# Altium project LaunchyRIO.PrjPcb
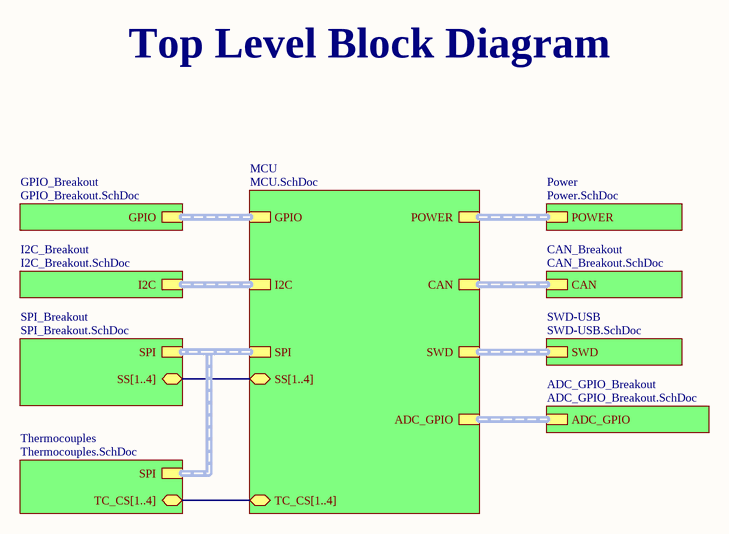
[diagram p0: MainSchematic.SchDoc]
11 sheets, 82 parts. Net scope: hierarchical (ports join the sheet entries above them; power ports are global).
Board file: LaunchyRIO-NoPour.PcbDoc
Sheets:
  MainSchematic.SchDoc
    I2C_Breakout = I2C_Breakout.SchDoc
    MCU = MCU.SchDoc
    GPIO_Breakout = GPIO_Breakout.SchDoc
    SPI_Breakout = SPI_Breakout.SchDoc
    CAN_Breakout = CAN_Breakout.SchDoc
    ADC_GPIO_Breakout = ADC_GPIO_Breakout.SchDoc
    SWD-USB = SWD-USB.SchDoc
    Power = Power.SchDoc
    Thermocouples = Thermocouples.SchDoc
      Thermocouple_Amplifier1 = Thermocouple_Amplifier.SchDoc
      Thermocouple_Amplifier2 = Thermocouple_Amplifier.SchDoc
      Thermocouple_Amplifier3 = Thermocouple_Amplifier.SchDoc
      Thermocouple_Amplifier4 = Thermocouple_Amplifier.SchDoc

## Sheet MainSchematic.SchDoc
size Letter; Organization: Altium Limited; Address1: L3, 12a Rodborough Rd; Address2: Frenchs Forest; Address3: NSW; Address4: Australia 2086

### Sub-sheets
ADC_GPIO_Breakout = ADC_GPIO_Breakout.SchDoc: ADC_GPIO (harness ADC_GPIO)
CAN_Breakout = CAN_Breakout.SchDoc: CAN (harness CAN)
GPIO_Breakout = GPIO_Breakout.SchDoc: GPIO (harness GPIO)
I2C_Breakout = I2C_Breakout.SchDoc: I2C (harness I2C)
MCU = MCU.SchDoc: I2C (harness I2C), GPIO (harness GPIO), SPI (harness SPI), ADC_GPIO (harness ADC_GPIO), CAN (harness CAN), SWD (harness SWD), POWER (harness POWER), TC_CS[1..4] (bidir), SS[1..4] (bidir)
Power = Power.SchDoc: POWER (harness POWER)
SPI_Breakout = SPI_Breakout.SchDoc: SPI (harness SPI), SS[1..4] (bidir)
SWD-USB = SWD-USB.SchDoc: SWD (harness SWD)
Thermocouples = Thermocouples.SchDoc: SPI (harness SPI), TC_CS[1..4] (bidir)

### Buses and harness runs
bus sheet MCU/SS[1..4] = sheet SPI_Breakout/SS[1..4]
bus sheet MCU/TC_CS[1..4] = sheet Thermocouples/TC_CS[1..4]
harness sheet ADC_GPIO_Breakout/ADC_GPIO = sheet MCU/ADC_GPIO
harness sheet CAN_Breakout/CAN = sheet MCU/CAN
harness sheet GPIO_Breakout/GPIO = sheet MCU/GPIO
harness sheet I2C_Breakout/I2C = sheet MCU/I2C
harness sheet MCU/POWER = sheet Power/POWER
harness sheet MCU/SPI = sheet SPI_Breakout/SPI = sheet Thermocouples/SPI
harness sheet MCU/SWD = sheet SWD-USB/SWD

### Notes on the sheet
- Top Level Block Diagram
- Title
- Size:
- Date:
- Letter
- Number:
- Time:
- Revision:
- Sheet
- of
- File:

## Sheet I2C_Breakout.SchDoc
size Letter; Organization: Altium Limited; Address1: L3, 12a Rodborough Rd; Address2: Frenchs Forest; Address3: NSW; Address4: Australia 2086
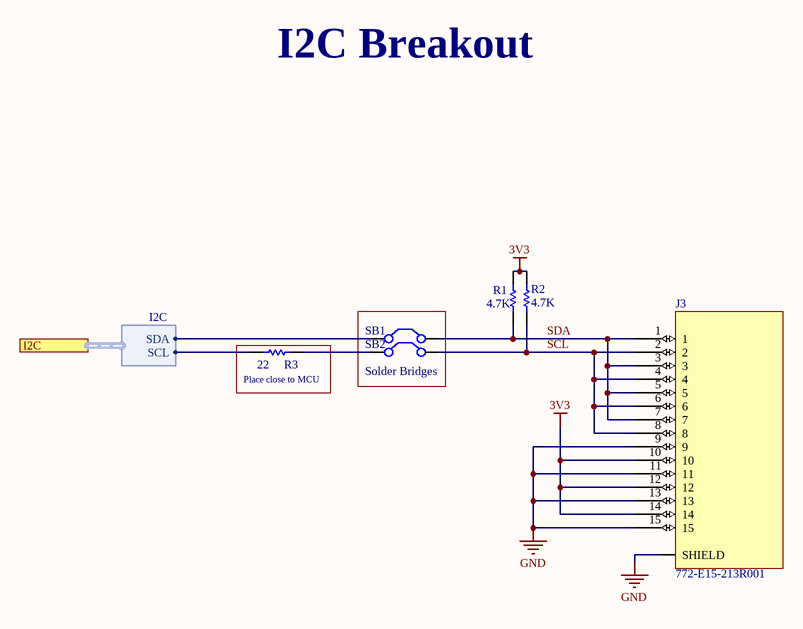
[diagram p1: I2C_Breakout.SchDoc]

### Parts
J3  772-E15-213R001  [15-Pos D-Sub]
R1  value 4.7K  [0402]  (hidden comment: Res1)
R2  value 4.7K  [0402]  (hidden comment: Res1)
R3  value 22  [0402]  (hidden comment: Res1)
SB1  Solder Bridge  [SB-2pos]  (value not drawn)
SB2  Solder Bridge  [SB-2pos]  (value not drawn)

### Blocks framed on the sheet
Place close to MCU: R3
Solder Bridges: SB1 SB2

### Ports
I2C (harness I2C)

### Harnesses
I2C: SDA, SCL

### Nets
3V3: J3.10 J3.12 J3.14 R1.2 R2.2
GND: J3.9 J3.11 J3.13 J3.15 J3.SHIELD
SCL: J3.2 J3.4 J3.6 J3.8 R2.1 SB2.2(C2)
SDA: J3.1 J3.3 J3.5 J3.7 R1.1 SB1.2(C2)
NetR3_1: R3.1 ; port I2C.SCL
NetR3_2: R3.2 SB2.1(C1)
NetSB1_1: SB1.1(C1) ; port I2C.SDA

### Notes on the sheet
- I2C Breakout
- Title
- Size:
- Date:
- Letter
- Number:
- Time:
- Revision:
- Sheet
- of
- File:

### Library data of the parts
J3 = 15-Position Connector: Number of Positions: 15; Connector Type: Receptacle, Female Sockets; Current Rating: 5A; Ingress Protection: IP67 - Dust Tight, Waterproof; Material Flammability Rating: UL94 V-0; Mounting Type: Panel Mount, Through Hole; Operating Temperature: -50°C ~ 100°C; Contact Type: Signal; Shell Material, Finish: Steel, Nickel Plated; Contact Finish: Gold; Manufacturer Part Number: 772-E15-213R001; DigiKey Part Number: NOR1010-ND
R1-R3 = Res1: Resistor
SB1 SB2 = Jumper: Jumper Wire

## Sheet MCU.SchDoc
size Letter; Organization: Altium Limited; Address1: L3, 12a Rodborough Rd; Address2: Frenchs Forest; Address3: NSW; Address4: Australia 2086
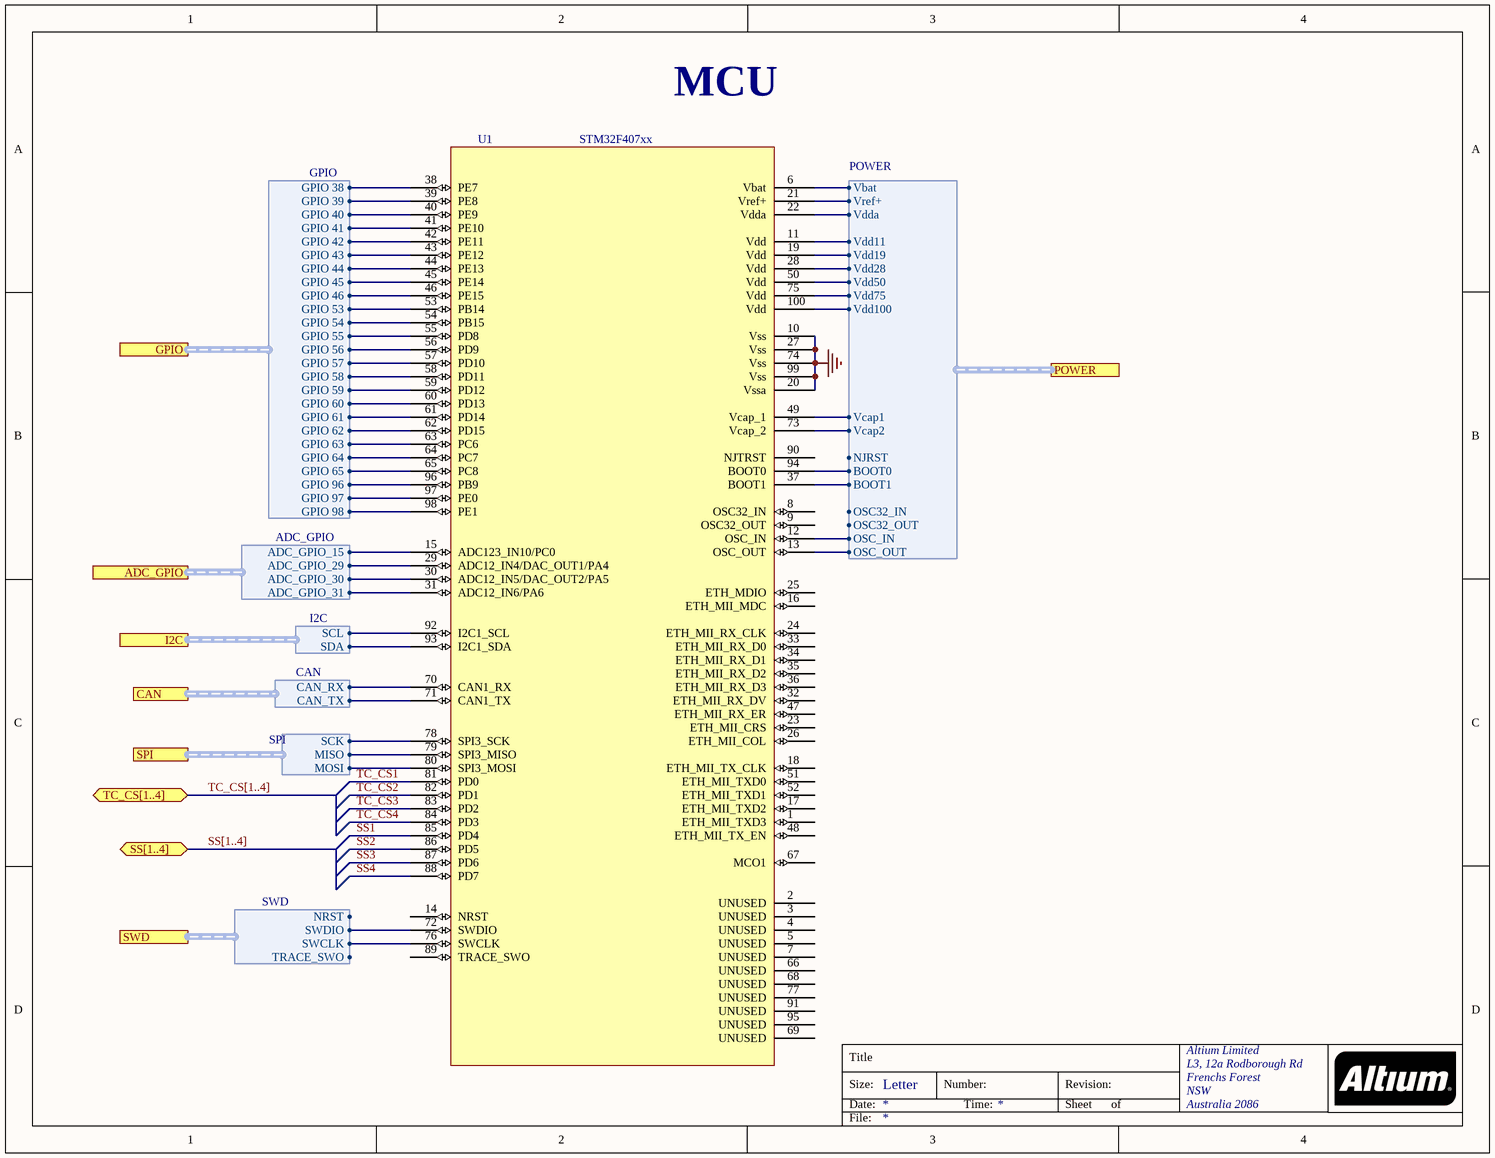
[diagram p2: MCU.SchDoc]

### Parts
U1  STM32F407xx  [LQFP100]

### Ports
ADC_GPIO (harness ADC_GPIO), CAN (harness CAN), GPIO (harness GPIO), I2C (harness I2C), POWER (harness POWER), SPI (harness SPI), SS[1..4] (bidir), SWD (harness SWD), TC_CS[1..4] (bidir)

### Harnesses
I2C: SCL, SDA
GPIO: GPIO 38, GPIO 39, GPIO 40, GPIO 41, GPIO 42, GPIO 43, GPIO 44, GPIO 45, GPIO 46, GPIO 53, GPIO 54, GPIO 55, GPIO 56, GPIO 57, GPIO 58, GPIO 59, GPIO 60, GPIO 61, GPIO 62, GPIO 63, GPIO 64, GPIO 65, GPIO 96, GPIO 97, GPIO 98
ADC_GPIO: ADC_GPIO_15, ADC_GPIO_29, ADC_GPIO_30, ADC_GPIO_31
CAN: CAN_RX, CAN_TX
SWD: NRST, SWDIO, SWCLK, TRACE_SWO
POWER: Vbat, Vref+, Vdda, Vcap1, Vcap2, NJRST, BOOT0, BOOT1, OSC32_IN, OSC32_OUT, OSC_IN, OSC_OUT, Vdd11, Vdd19, Vdd28, Vdd50, Vdd75, Vdd100
SPI: SCK, MISO, MOSI

### Nets
GND: U1.10(Vss) U1.20(Vssa) U1.27(Vss) U1.74(Vss) U1.99(Vss)
GPIO 38: U1.38(PE7) ; port GPIO.GPIO 38
GPIO 39: U1.39(PE8) ; port GPIO.GPIO 39
GPIO 40: U1.40(PE9) ; port GPIO.GPIO 40
GPIO 41: U1.41(PE10) ; port GPIO.GPIO 41
GPIO 42: U1.42(PE11) ; port GPIO.GPIO 42
GPIO 43: U1.43(PE12) ; port GPIO.GPIO 43
GPIO 44: U1.44(PE13) ; port GPIO.GPIO 44
GPIO 45: U1.45(PE14) ; port GPIO.GPIO 45
GPIO 46: U1.46(PE15) ; port GPIO.GPIO 46
GPIO 53: U1.53(PB14) ; port GPIO.GPIO 53
GPIO 54: U1.54(PB15) ; port GPIO.GPIO 54
GPIO 55: U1.55(PD8) ; port GPIO.GPIO 55
GPIO 56: U1.56(PD9) ; port GPIO.GPIO 56
GPIO 57: U1.57(PD10) ; port GPIO.GPIO 57
GPIO 58: U1.58(PD11) ; port GPIO.GPIO 58
GPIO 59: U1.59(PD12) ; port GPIO.GPIO 59
GPIO 60: U1.60(PD13) ; port GPIO.GPIO 60
GPIO 61: U1.61(PD14) ; port GPIO.GPIO 61
GPIO 62: U1.62(PD15) ; port GPIO.GPIO 62
GPIO 63: U1.63(PC6) ; port GPIO.GPIO 63
GPIO 64: U1.64(PC7) ; port GPIO.GPIO 64
GPIO 65: U1.65(PC8) ; port GPIO.GPIO 65
GPIO 96: U1.96(PB9) ; port GPIO.GPIO 96
GPIO 97: U1.97(PE0) ; port GPIO.GPIO 97
GPIO 98: U1.98(PE1) ; port GPIO.GPIO 98
SS1: U1.85(PD4)
SS2: U1.86(PD5)
SS3: U1.87(PD6)
SS4: U1.88(PD7)
T_JTCK: U1.76(SWCLK) ; port SWD.SWCLK
T_JTMS: U1.72(SWDIO) ; port SWD.SWDIO
TC_CS1: U1.81(PD0)  [project net CS]
TC_CS2: U1.82(PD1)  [project net CS]
TC_CS3: U1.83(PD2)  [project net CS]
TC_CS4: U1.84(PD3)  [project net CS]
NetC22_2: U1.6(Vbat) ; port POWER.Vbat
NetC23_2: U1.100(Vdd) ; port POWER.Vdd100
NetC24_2: U1.75(Vdd) ; port POWER.Vdd75
NetC25_2: U1.50(Vdd) ; port POWER.Vdd50
NetC26_2: U1.28(Vdd) ; port POWER.Vdd28
NetC27_2: U1.19(Vdd) ; port POWER.Vdd19
NetC28_2: U1.11(Vdd) ; port POWER.Vdd11
NetC29_2: U1.49(Vcap_1) ; port POWER.Vcap1
NetC30_2: U1.73(Vcap_2) ; port POWER.Vcap2
NetC31_2: U1.22(Vdda) ; port POWER.Vdda
NetC33_1: U1.21(Vref+) ; port POWER.Vref+
NetJ4_1: U1.15(ADC123_IN10/PC0) ; port ADC_GPIO.ADC_GPIO_15
NetJ4_2: U1.29(ADC12_IN4/DAC_OUT1/PA4) ; port ADC_GPIO.ADC_GPIO_29
NetJ4_3: U1.30(ADC12_IN5/DAC_OUT2/PA5) ; port ADC_GPIO.ADC_GPIO_30
NetJ4_4: U1.31(ADC12_IN6/PA6) ; port ADC_GPIO.ADC_GPIO_31
NetR3_1: U1.92(I2C1_SCL) ; port I2C.SCL
NetR7_1: U1.78(SPI3_SCK) ; port SPI.SCK
NetR16_2: U1.12(OSC_IN) ; port POWER.OSC_IN
NetR17_2: U1.94(BOOT0) ; port POWER.BOOT0
NetR18_2: U1.37(BOOT1) ; port POWER.BOOT1
NetSB1_1: U1.93(I2C1_SDA) ; port I2C.SDA
NetSB3_1: U1.79(SPI3_MISO) ; port SPI.MISO
NetSB4_1: U1.80(SPI3_MOSI) ; port SPI.MOSI
NetSB11_1: U1.13(OSC_OUT) ; port POWER.OSC_OUT
NetU1_70: U1.70(CAN1_RX) ; port CAN.CAN_RX
NetU1_71: U1.71(CAN1_TX) ; port CAN.CAN_TX

Not connected (* = marked no-connect by the designer): U1 1(ETH_MII_TXD3) 2(UNUSED) 3(UNUSED) 4(UNUSED) 5(UNUSED) 7(UNUSED) 8(OSC32_IN) 9(OSC32_OUT) 14(NRST) 16(ETH_MII_MDC) 17(ETH_MII_TXD2) 18(ETH_MII_TX_CLK) 23(ETH_MII_CRS) 24(ETH_MII_RX_CLK) 25(ETH_MDIO) 26(ETH_MII_COL) 32(ETH_MII_RX_DV) 33(ETH_MII_RX_D0) 34(ETH_MII_RX_D1) 35(ETH_MII_RX_D2) 36(ETH_MII_RX_D3) 47(ETH_MII_RX_ER) 48(ETH_MII_TX_EN) 51(ETH_MII_TXD0) 52(ETH_MII_TXD1) 66(UNUSED) 67(MCO1) 68(UNUSED) 69(UNUSED) 77(UNUSED) 89(TRACE_SWO) 90(NJTRST) 91(UNUSED) 95(UNUSED)

### Buses and harness runs
bus SS[1..4] = port SS[1..4]
bus TC_CS[1..4] = port TC_CS[1..4]

### Notes on the sheet
- MCU
- Title
- Size:
- Date:
- Letter
- Number:
- Time:
- Revision:
- Sheet
- of
- File:

## Sheet GPIO_Breakout.SchDoc
size Letter; Organization: Altium Limited; Address1: L3, 12a Rodborough Rd; Address2: Frenchs Forest; Address3: NSW; Address4: Australia 2086
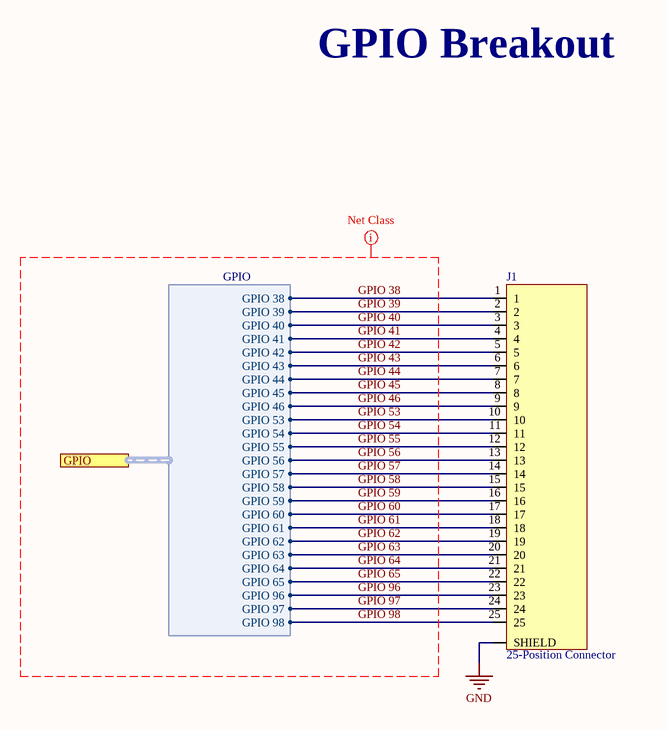
[diagram p3: GPIO_Breakout.SchDoc]

### Parts
J1  25-Position Connector  [25-POS D-SUB]

### Ports
GPIO (harness GPIO)

### Harnesses
GPIO: GPIO 38, GPIO 39, GPIO 40, GPIO 41, GPIO 42, GPIO 43, GPIO 44, GPIO 45, GPIO 46, GPIO 53, GPIO 54, GPIO 55, GPIO 56, GPIO 57, GPIO 58, GPIO 59, GPIO 60, GPIO 61, GPIO 62, GPIO 63, GPIO 64, GPIO 65, GPIO 96, GPIO 97, GPIO 98

### Nets
GND: J1.SHIELD
GPIO 38: J1.1 ; port GPIO.GPIO 38
GPIO 39: J1.2 ; port GPIO.GPIO 39
GPIO 40: J1.3 ; port GPIO.GPIO 40
GPIO 41: J1.4 ; port GPIO.GPIO 41
GPIO 42: J1.5 ; port GPIO.GPIO 42
GPIO 43: J1.6 ; port GPIO.GPIO 43
GPIO 44: J1.7 ; port GPIO.GPIO 44
GPIO 45: J1.8 ; port GPIO.GPIO 45
GPIO 46: J1.9 ; port GPIO.GPIO 46
GPIO 53: J1.10 ; port GPIO.GPIO 53
GPIO 54: J1.11 ; port GPIO.GPIO 54
GPIO 55: J1.12 ; port GPIO.GPIO 55
GPIO 56: J1.13 ; port GPIO.GPIO 56
GPIO 57: J1.14 ; port GPIO.GPIO 57
GPIO 58: J1.15 ; port GPIO.GPIO 58
GPIO 59: J1.16 ; port GPIO.GPIO 59
GPIO 60: J1.17 ; port GPIO.GPIO 60
GPIO 61: J1.18 ; port GPIO.GPIO 61
GPIO 62: J1.19 ; port GPIO.GPIO 62
GPIO 63: J1.20 ; port GPIO.GPIO 63
GPIO 64: J1.21 ; port GPIO.GPIO 64
GPIO 65: J1.22 ; port GPIO.GPIO 65
GPIO 96: J1.23 ; port GPIO.GPIO 96
GPIO 97: J1.24 ; port GPIO.GPIO 97
GPIO 98: J1.25 ; port GPIO.GPIO 98

### Layout directives
net class GPIO: GPIO 38, GPIO 39, GPIO 40, GPIO 41, GPIO 42, GPIO 43, GPIO 44, GPIO 45, GPIO 46, GPIO 53, GPIO 54, GPIO 55, GPIO 56, GPIO 57, GPIO 58, GPIO 59, GPIO 60, GPIO 61, GPIO 62, GPIO 63, GPIO 64, GPIO 65, GPIO 96, GPIO 97, GPIO 98

### Notes on the sheet
- GPIO Breakout
- Title
- Size:
- Date:
- Letter
- Number:
- Time:
- Revision:
- Sheet
- of
- File:

### Library data of the parts
J1 = 25-Position Connector: Manufacturer Part Number: 772-E25-213R051; DigiKey Part Number: NOR1066-ND

## Sheet SPI_Breakout.SchDoc
size Letter; Organization: Altium Limited; Address1: L3, 12a Rodborough Rd; Address2: Frenchs Forest; Address3: NSW; Address4: Australia 2086
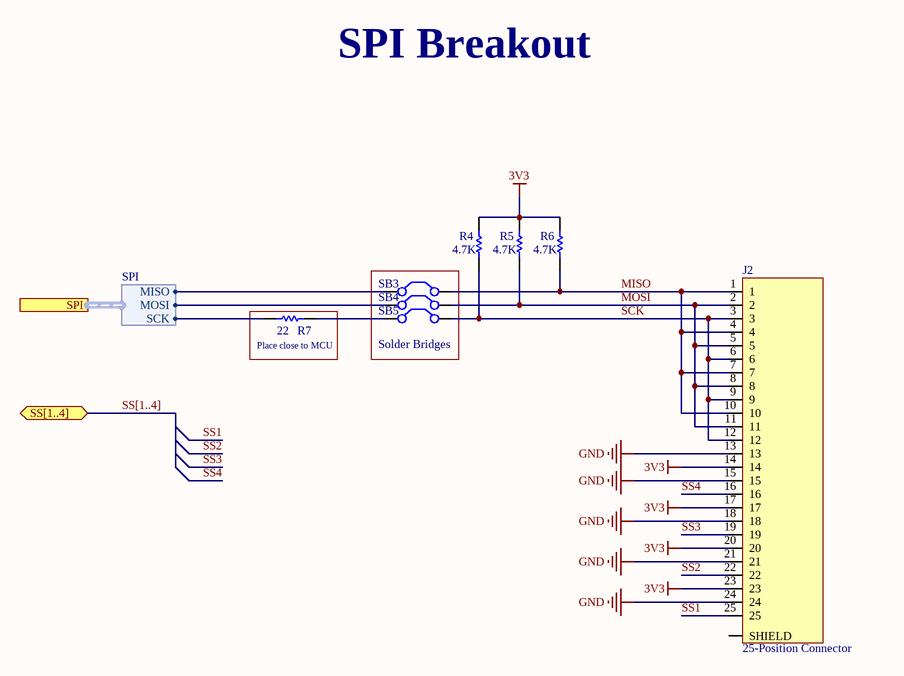
[diagram p4: SPI_Breakout.SchDoc]

### Parts
J2  25-Position Connector  [25-POS D-SUB]
R4  value 4.7K  [0402]  (hidden comment: Res1)
R5  value 4.7K  [0402]  (hidden comment: Res1)
R6  value 4.7K  [0402]  (hidden comment: Res1)
R7  value 22  [0402]  (hidden comment: Res1)
SB3  Solder Bridge  [SB-2pos]  (value not drawn)
SB4  Solder Bridge  [SB-2pos]  (value not drawn)
SB5  Solder Bridge  [SB-2pos]  (value not drawn)

### Blocks framed on the sheet
Solder Bridges: SB3-SB5
Place close to MCU: R7

### Ports
SPI (harness SPI), SS[1..4] (bidir)

### Harnesses
SPI: MISO, MOSI, SCK

### Nets
3V3: J2.14 J2.17 J2.20 J2.23 R4.1 R5.2 R6.1
GND: J2.13 J2.15 J2.18 J2.21 J2.24
MISO: J2.1 J2.4 J2.7 J2.10 R6.2 SB3.2(C2)
MOSI: J2.2 J2.5 J2.8 J2.11 R5.1 SB4.2(C2)
SCK: J2.3 J2.6 J2.9 J2.12 R4.2 SB5.2(C2)
SS1: J2.25
SS2: J2.22
SS3: J2.19
SS4: J2.16
NetR7_1: R7.1 ; port SPI.SCK
NetR7_2: R7.2 SB5.1(C1)
NetSB3_1: SB3.1(C1) ; port SPI.MISO
NetSB4_1: SB4.1(C1) ; port SPI.MOSI

Not connected (* = marked no-connect by the designer): J2 SHIELD

### Buses and harness runs
bus SS[1..4] = port SS[1..4]

### Notes on the sheet
- SPI Breakout
- Title
- Size:
- Date:
- Letter
- Number:
- Time:
- Revision:
- Sheet
- of
- File:

### Library data of the parts
J2 = 25-Position Connector: as J1 on sheet GPIO_Breakout; DigiKey Part Number: NOR1066-ND
R4-R7 = Res1: Resistor
SB3-SB5 = Jumper: Jumper Wire

## Sheet CAN_Breakout.SchDoc
size Letter; Organization: Altium Limited; Address1: L3, 12a Rodborough Rd; Address2: Frenchs Forest; Address3: NSW; Address4: Australia 2086
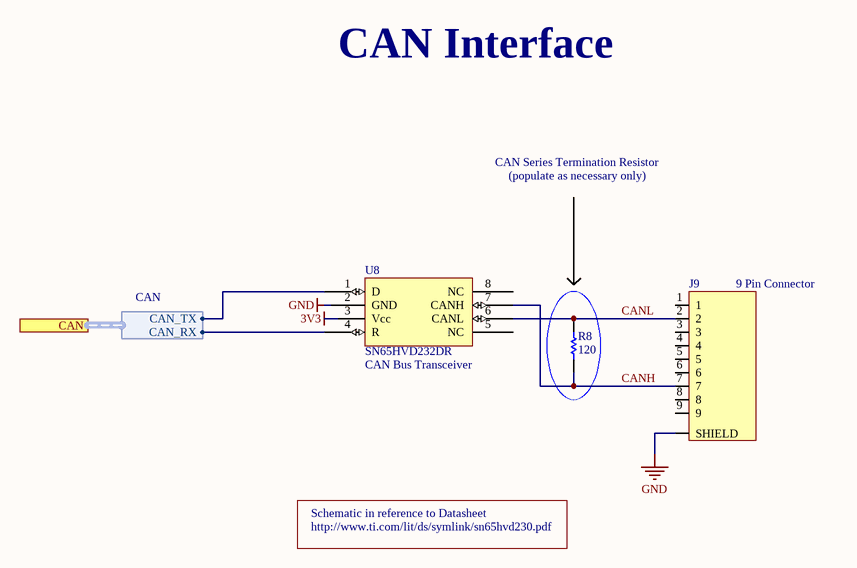
[diagram p5: CAN_Breakout.SchDoc]

### Parts
J9  9 Pin Connector  [9-Pos D-Sub]
R8  value 120  [0402]  (hidden comment: Res1)
U8  CAN Bus Transceiver  [8SOIC-CAN-TRANSCEIVER]

### Ports
CAN (harness CAN)

### Harnesses
CAN: CAN_RX, CAN_TX

### Nets
3V3: U8.3(Vcc)
GND: J9.SHIELD U8.2(GND)
CANH: J9.7 R8.1 U8.7(CANH)
CANL: J9.2 R8.2 U8.6(CANL)
NetU1_70: U8.4(R) ; port CAN.CAN_RX
NetU1_71: U8.1(D) ; port CAN.CAN_TX

Not connected (* = marked no-connect by the designer): J9 1 3 4 5 6 8 9; U8 5(NC) 8(NC)

### Notes on the sheet
- CAN Interface
- CAN Series Termination Resistor
- (populate as necessary only)
- http://www.ti.com/lit/ds/symlink/sn65hvd230.pdf
- Schematic in reference to Datasheet
- Title
- Size:
- Date:
- Letter
- Number:
- Time:
- Revision:
- Sheet
- of
- File:

### Library data of the parts
J9 = 9-Position Connector: Unknown parameter: 772-E09-213R011
R8 = Res1: Resistor
U8 = SN65HVD232DR: Manufacturer: Texas Instruments; Max Data Rate: 1Mbps; Supply Voltage: 3V ~ 3.6V; Manufacturer Part Number: SN65HVD232DR; DigiKey Part Number: 296-26344-1-ND; Operating Temperature: -40 ~ 85 C

## Sheet ADC_GPIO_Breakout.SchDoc
size Letter; Organization: Altium Limited; Address1: L3, 12a Rodborough Rd; Address2: Frenchs Forest; Address3: NSW; Address4: Australia 2086
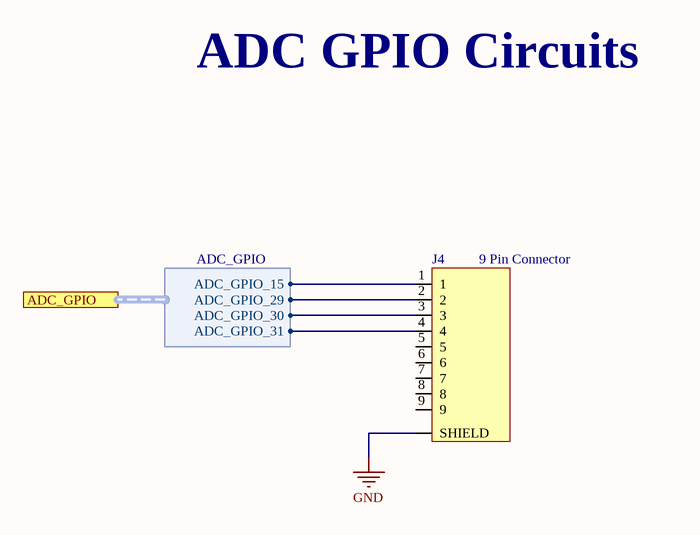
[diagram p6: ADC_GPIO_Breakout.SchDoc]

### Parts
J4  9 Pin Connector  [9-Pos D-Sub]

### Ports
ADC_GPIO (harness ADC_GPIO)

### Harnesses
ADC_GPIO: ADC_GPIO_15, ADC_GPIO_29, ADC_GPIO_30, ADC_GPIO_31

### Nets
GND: J4.SHIELD
NetJ4_1: J4.1 ; port ADC_GPIO.ADC_GPIO_15
NetJ4_2: J4.2 ; port ADC_GPIO.ADC_GPIO_29
NetJ4_3: J4.3 ; port ADC_GPIO.ADC_GPIO_30
NetJ4_4: J4.4 ; port ADC_GPIO.ADC_GPIO_31

Not connected (* = marked no-connect by the designer): J4 5 6 7 8 9

### Notes on the sheet
- ADC GPIO Circuits
- Title
- Size:
- Date:
- Letter
- Number:
- Time:
- Revision:
- Sheet
- of
- File:

### Library data of the parts
J4 = 9-Position Connector: Unknown parameter: 772-E09-213R011

## Sheet SWD-USB.SchDoc
size Letter; Organization: Altium Limited; Address1: L3, 12a Rodborough Rd; Address2: Frenchs Forest; Address3: NSW; Address4: Australia 2086
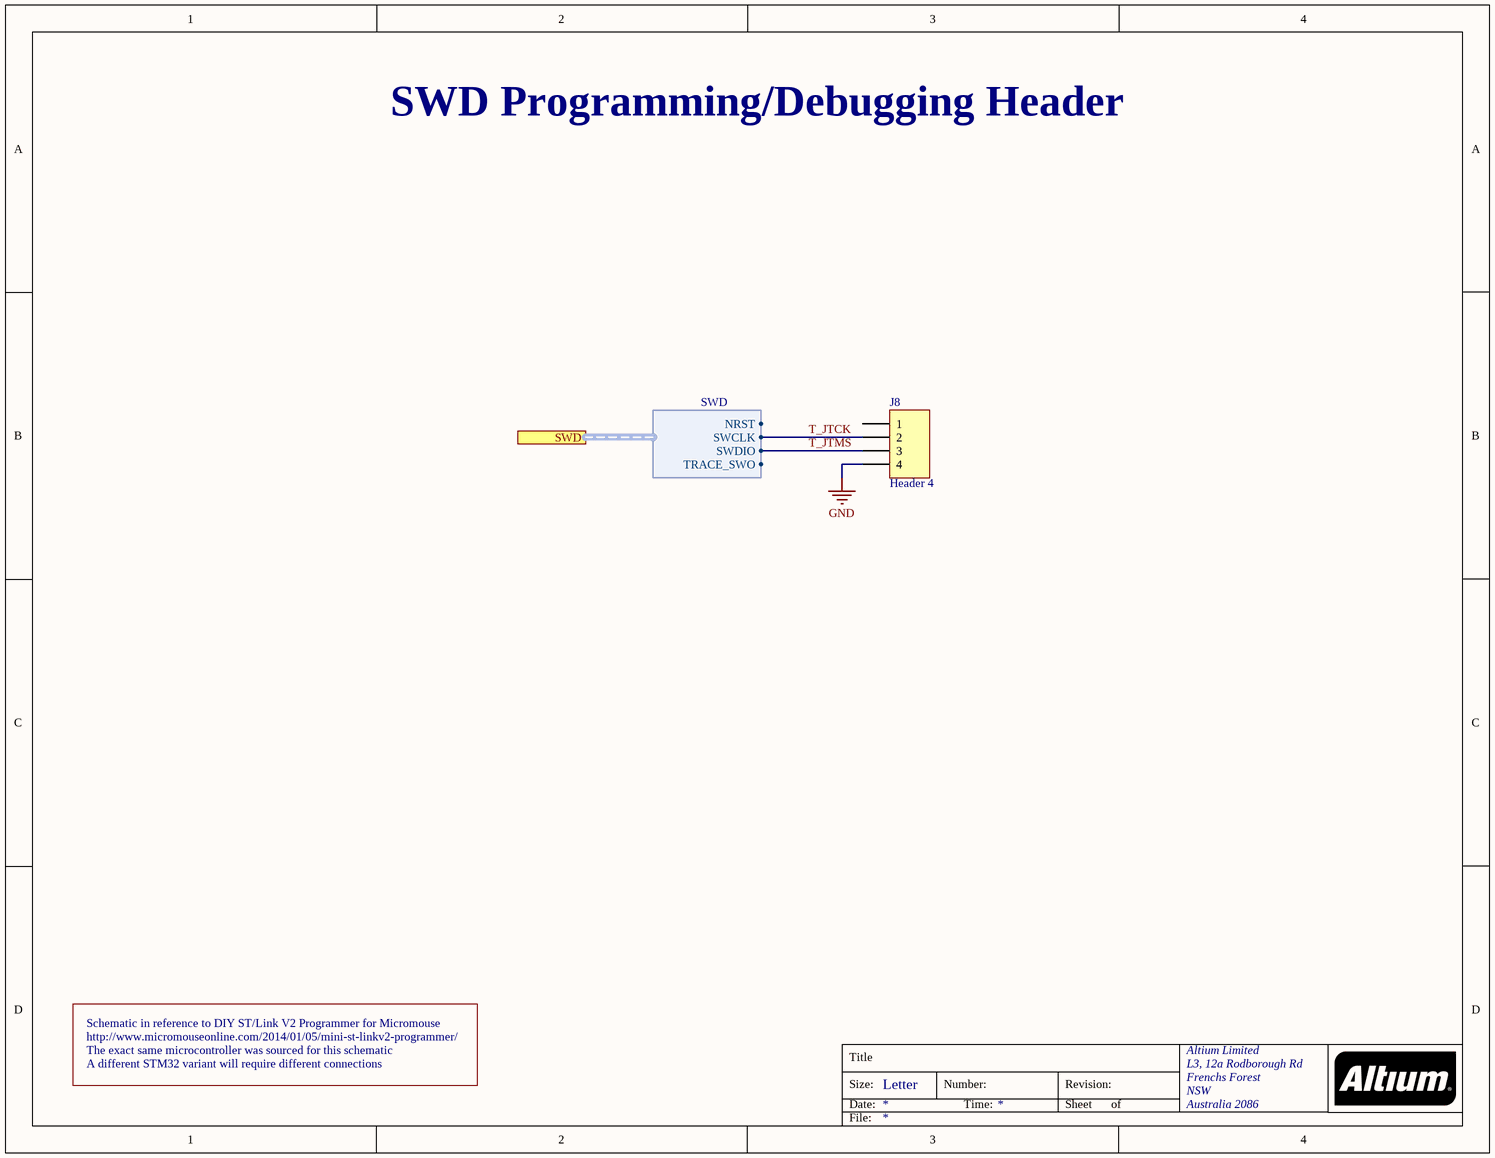
[diagram p7: SWD-USB.SchDoc]

### Parts
J8  Header 4  [HDR1X4]

### Ports
SWD (harness SWD)

### Harnesses
SWD: NRST, SWCLK, SWDIO, TRACE_SWO

### Nets
GND: J8.4
T_JTCK: J8.2 ; port SWD.SWCLK
T_JTMS: J8.3 ; port SWD.SWDIO

Not connected (* = marked no-connect by the designer): J8 1

### Notes on the sheet
- SWD Programming/Debugging Header
- http://www.micromouseonline.com/2014/01/05/mini-st-linkv2-programmer/
- Schematic in reference to DIY ST/Link V2 Programmer for Micromouse
- The exact same microcontroller was sourced for this schematic
- A different STM32 variant will require different connections
- Title
- Size:
- Date:
- Letter
- Number:
- Time:
- Revision:
- Sheet
- of
- File:

### Library data of the parts
J8 = Header 4: Header, 4-Pin; LatestRevisionDate: 17-Jul-2002; LatestRevisionNote: Re-released for DXP Platform.; Publisher: Altium Limited

## Sheet Power.SchDoc
size Letter; Organization: Altium Limited; Address1: L3, 12a Rodborough Rd; Address2: Frenchs Forest; Address3: NSW; Address4: Australia 2086
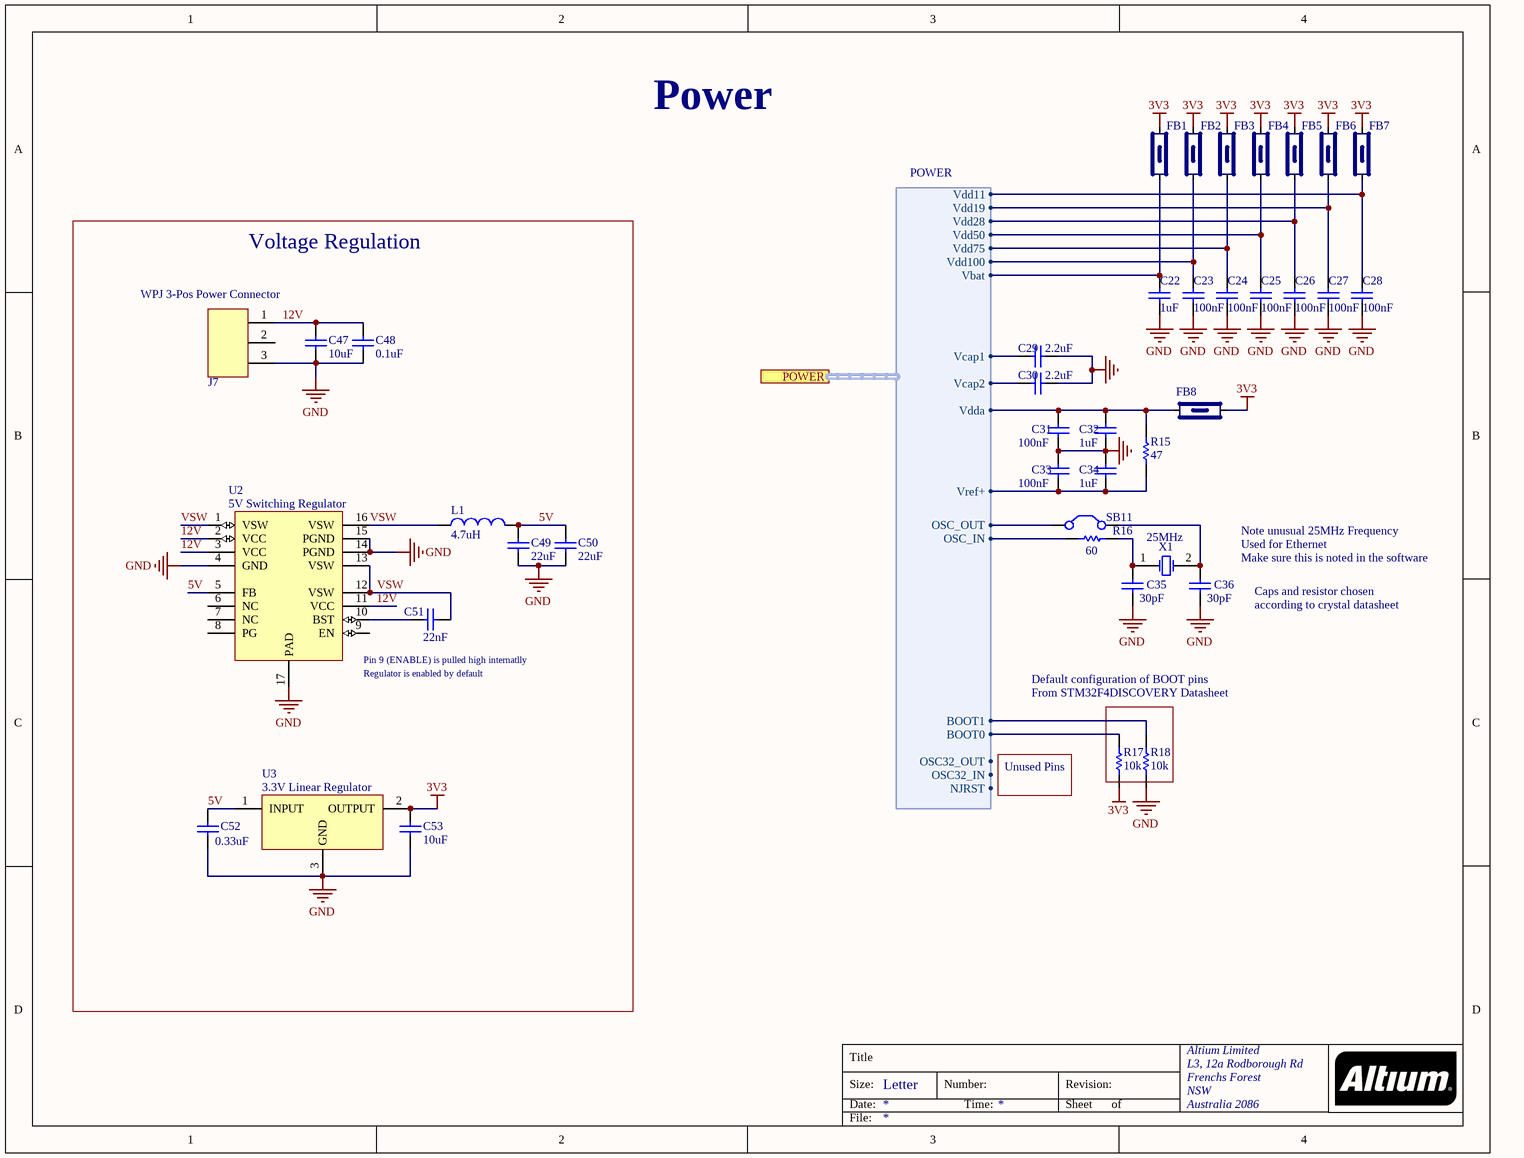
[diagram p8: Power.SchDoc]

### Parts
C22  value 1uF  [0402]
C23  value 100nF  [0402]
C24  value 100nF  [0402]
C25  value 100nF  [0402]
C26  value 100nF  [0402]
C27  value 100nF  [0402]
C28  value 100nF  [0402]
C29  value 2.2uF  [0402]
C30  value 2.2uF  [0402]
C31  value 100nF  [0402]
C32  value 1uF  [0402]
C33  value 100nF  [0402]
C34  value 1uF  [0402]
C35  value 30pF  [0402]
C36  value 30pF  [0402]
C47  value 10uF  [0402]  (hidden comment: Cap)
C48  value 0.1uF  [0402]  (hidden comment: Cap)
C49  value 22uF  [0402]  (hidden comment: Cap)
C50  value 22uF  [0402]  (hidden comment: Cap)
C51  value 22nF  [0402]  (hidden comment: Cap)
C52  value 0.33uF  [0402]  (hidden comment: Cap)
C53  value 10uF  [0402]  (hidden comment: Cap)
FB1  Ferrite Bead  [0402]  (value not drawn)
FB2  Ferrite Bead  [0402]  (value not drawn)
FB3  Ferrite Bead  [0402]  (value not drawn)
FB4  Ferrite Bead  [0402]  (value not drawn)
FB5  Ferrite Bead  [0402]  (value not drawn)
FB6  Ferrite Bead  [0402]  (value not drawn)
FB7  Ferrite Bead  [0402]  (value not drawn)
FB8  Ferrite Bead  [0402]  (value not drawn)
J7  WPJ 3-Pos Power Connector  [WPJ-3Pos]
L1  value 4.7uH  [Inductor]  (hidden comment: Inductor)
R15  value 47  [0402]  (hidden comment: Res1)
R16  value 60  [0402]  (hidden comment: Res1)
R17  value 10k  [0402]  (hidden comment: Res1)
R18  value 10k  [0402]  (hidden comment: Res1)
SB11  Jumper  [SB-2pos]  (value not drawn)
U2  5V Switching Regulator  [VQFN16]
U3  3.3V Linear Regulator  [DPAK]
X1  Frequency: 25MHz  [4SMD 25MHZ CRYSTAL]  (hidden comment: XTAL)

### Blocks framed on the sheet
Voltage Regulation: C47-C53 J7 L1 U2 U3

### Ports
POWER (harness POWER)

### Harnesses
POWER: BOOT0, BOOT1, NJRST, OSC_IN, OSC_OUT, OSC32_IN, OSC32_OUT, Vbat, Vcap1, Vcap2, Vdd100, Vdd11, Vdd19, Vdd28, Vdd50, Vdd75, Vdda, Vref+

### Nets
3V3: C53.1 FB1.2 FB2.2 FB3.2 FB4.2 FB5.2 FB6.2 FB7.2 FB8.2 R17.1 U3.2(OUTPUT)
GND: C22.1 C23.1 C24.1 C25.1 C26.1 C27.1 C28.1 C29.1 C30.1 C31.1 C32.1 C33.2 C34.2 C35.1 C36.1 C47.1 C48.1 C49.2 C50.2 C52.2 C53.2 J7.3 R18.1 U2.4(GND) U2.14(PGND) U2.15(PGND) U2.17(PAD) U3.3(GND)
5V: C49.1 C50.1 C52.1 L1.2 U2.5(FB) U3.1(INPUT)
12V: C47.2 C48.2 J7.1 U2.2(VCC) U2.3(VCC) U2.11(VCC)
VSW: C51.1 L1.1 U2.1(VSW) U2.12(VSW) U2.13(VSW) U2.16(VSW)
NetC22_2: C22.2 FB1.1 ; port POWER.Vbat
NetC23_2: C23.2 FB2.1 ; port POWER.Vdd100
NetC24_2: C24.2 FB3.1 ; port POWER.Vdd75
NetC25_2: C25.2 FB4.1 ; port POWER.Vdd50
NetC26_2: C26.2 FB5.1 ; port POWER.Vdd28
NetC27_2: C27.2 FB6.1 ; port POWER.Vdd19
NetC28_2: C28.2 FB7.1 ; port POWER.Vdd11
NetC29_2: C29.2 ; port POWER.Vcap1
NetC30_2: C30.2 ; port POWER.Vcap2
NetC31_2: C31.2 C32.2 FB8.1 R15.2 ; port POWER.Vdda
NetC33_1: C33.1 C34.1 R15.1 ; port POWER.Vref+
NetC35_2: C35.2 R16.1 X1.1(OSC1)
NetC36_2: C36.2 SB11.2(C2) X1.2(OSC2)
NetC51_2: C51.2 U2.10(BST)
NetR16_2: R16.2 ; port POWER.OSC_IN
NetR17_2: R17.2 ; port POWER.BOOT0
NetR18_2: R18.2 ; port POWER.BOOT1
NetSB11_1: SB11.1(C1) ; port POWER.OSC_OUT

Not connected (* = marked no-connect by the designer): J7 2; U2 6(NC) 7(NC) 8(PG) 9(EN)

### Notes on the sheet
- Power
- Note unusual 25MHz Frequency
- Used for Ethernet
- Make sure this is noted in the software
- Caps and resistor chosen
- according to crystal datasheet
- (near U2) Pin 9 (ENABLE) is pulled high internatlly
- (near U2) Regulator is enabled by default
- Default configuration of BOOT pins
- From STM32F4DISCOVERY Datasheet
- Unused Pins
- Title
- Size:
- Date:
- Letter
- Number:
- Time:
- Revision:
- Sheet
- of
- File:

### Library data of the parts
C22-C36 C47-C53 = Cap: Capacitor
  C47 C48: Published: 8-Jun-2000; LatestRevisionDate: 17-Jul-2002; LatestRevisionNote: Re-released for DXP Platform.; PackageReference: RAD-0.3; Publisher: Altium Limited; PackageDescription: Radial Cap, Thru-Hole; 2 Leads; 0.3 in Pin Spacing
J7 = WPJ 3-Pos Power Connector: Manufacturer PN: B03B-WPJSS-1(LF)(SN); DigiKey PN: 455-2448-ND
R15-R18 = Res1: Resistor
SB11 = Jumper: Jumper Wire
X1 = XTAL: Crystal Oscillator; Mnf Part No: FL2500316Z; DigiKey Part Number: FL2500316ZTR-ND
L1 = Inductor: DigiKey PN: 587-2100-1-ND
U2 = 5V Switching Regulator: DigiKey PN: TS30011-M050QFNRCT-ND
U3 = 3.3V Linear Regulator: DigiKey PN: 497-1496-1-ND

## Sheet Thermocouples.SchDoc
size Letter; Organization: Altium Limited; Address1: L3, 12a Rodborough Rd; Address2: Frenchs Forest; Address3: NSW; Address4: Australia 2086
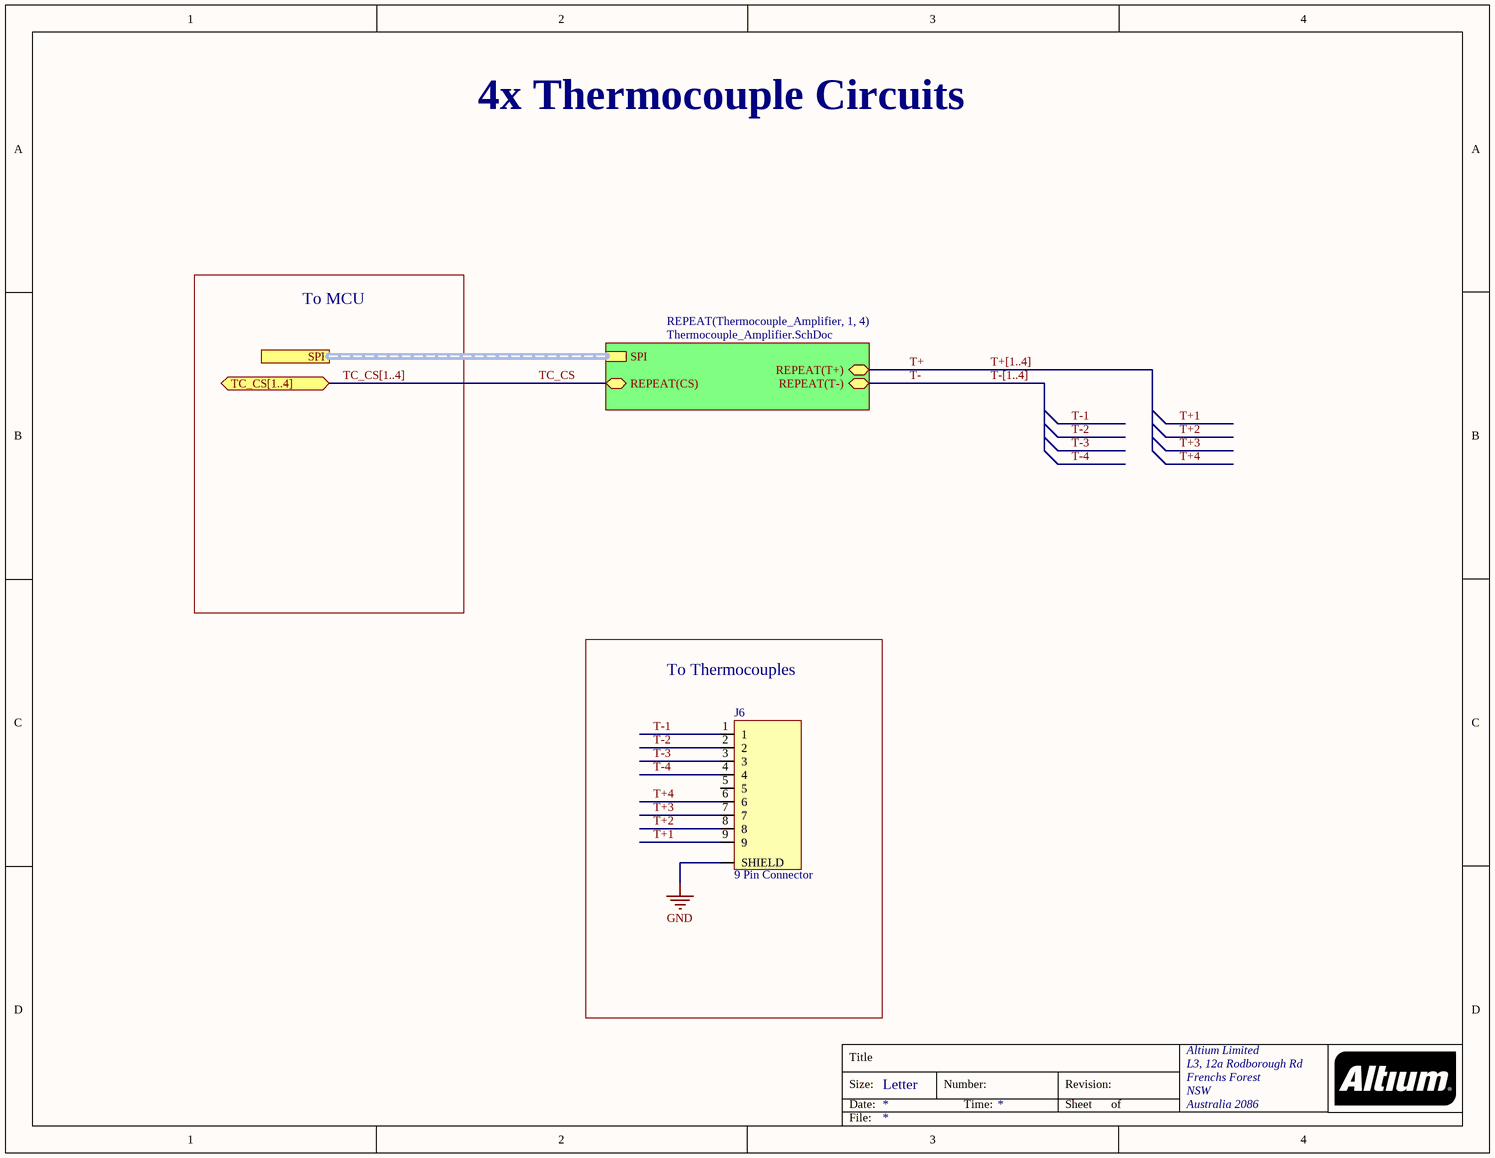
[diagram p9: Thermocouples.SchDoc]

### Parts
J6  9 Pin Connector  [9-Pos D-Sub]

### Blocks framed on the sheet
To Thermocouples: J6

### Sub-sheets
REPEAT(Thermocouple_Amplifier, 1, 4) = Thermocouple_Amplifier.SchDoc: SPI (harness SPI), REPEAT(CS) (bidir), REPEAT(T+) (bidir), REPEAT(T-) (bidir)

### Ports
SPI (harness SPI), TC_CS[1..4] (bidir)

### Nets
GND: J6.SHIELD
T+: sheet REPEAT(Thermocouple_Amplifier, 1, 4)/REPEAT(T+)
T+1: J6.9  [project net T+]
T+2: J6.8  [project net T+]
T+3: J6.7  [project net T+]
T+4: J6.6  [project net T+]
T-: sheet REPEAT(Thermocouple_Amplifier, 1, 4)/REPEAT(T-)
T-1: J6.1  [project net T-]
T-2: J6.2  [project net T-]
T-3: J6.3  [project net T-]
T-4: J6.4  [project net T-]
TC_CS: sheet REPEAT(Thermocouple_Amplifier, 1, 4)/REPEAT(CS)

Not connected (* = marked no-connect by the designer): J6 5

### Buses and harness runs
bus T+[1..4]
bus T-[1..4]
bus TC_CS[1..4] = port TC_CS[1..4]
harness port SPI = sheet REPEAT(Thermocouple_Amplifier, 1, 4)/SPI

### Notes on the sheet
- 4x Thermocouple Circuits
- To MCU
- Title
- Size:
- Date:
- Letter
- Number:
- Time:
- Revision:
- Sheet
- of
- File:

### Library data of the parts
J6 = 9-Position Connector: Unknown parameter: 772-E09-213R011

## Sheet Thermocouple_Amplifier.SchDoc
size Letter; Organization: Altium Limited; Address1: L3, 12a Rodborough Rd; Address2: Frenchs Forest; Address3: NSW; Address4: Australia 2086
Used 4 times, as channels Thermocouples/Thermocouple_Amplifier1, Thermocouples/Thermocouple_Amplifier2, Thermocouples/Thermocouple_Amplifier3, Thermocouples/Thermocouple_Amplifier4. Parts and nets are listed once, with the designators drawn on the sheet.
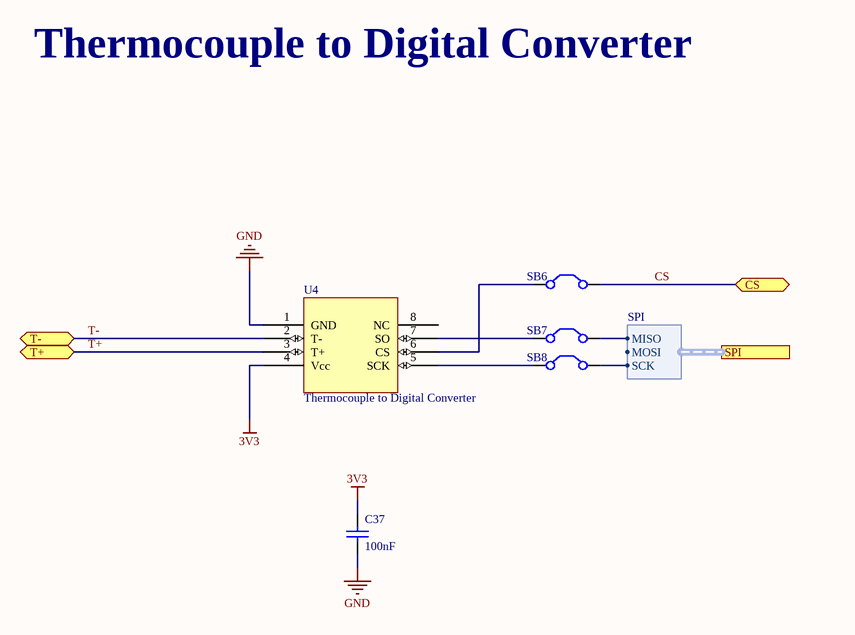
[diagram p10: Thermocouple_Amplifier.SchDoc]

### Parts
C37  value 100nF  [0402]  (hidden comment: Cap)
SB6  Solder Bridge  [SB-2pos]  (value not drawn)
SB7  Solder Bridge  [SB-2pos]  (value not drawn)
SB8  Solder Bridge  [SB-2pos]  (value not drawn)
U4  Thermocouple to Digital Converter  [8-SOIC MAXIM]

### Ports
CS (bidir), SPI (harness SPI), T+ (bidir), T- (bidir)

### Harnesses
SPI: MISO, MOSI, SCK

### Nets
3V3: C37.2 U4.4(Vcc)
GND: C37.1 U4.1(GND)
CS: SB6.2(C2) ; port CS
T+: U4.3(T+) ; port T+
T-: U4.2(T-) ; port T-
NetSB6_1: SB6.1(C1) U4.6(CS)
NetSB7_1: SB7.1(C1) U4.7(SO)
NetSB7_2: SB7.2(C2) ; port SPI.MISO
NetSB8_1: SB8.1(C1) U4.5(SCK)
NetSB8_2: SB8.2(C2) ; port SPI.SCK

Not connected (* = marked no-connect by the designer): U4 8(NC)

### Channels
Thermocouples/Thermocouple_Amplifier1: designators end in _Thermocouple_Amplifier1; ports CS=CS T+=T+ T-=T-
Thermocouples/Thermocouple_Amplifier2: designators end in _Thermocouple_Amplifier2; ports CS=CS T+=T+ T-=T-
Thermocouples/Thermocouple_Amplifier3: designators end in _Thermocouple_Amplifier3; ports CS=CS T+=T+ T-=T-
Thermocouples/Thermocouple_Amplifier4: designators end in _Thermocouple_Amplifier4; ports CS=CS T+=T+ T-=T-

### Notes on the sheet
- Thermocouple to Digital Converter
- Title
- Size:
- Date:
- Letter
- Number:
- Time:
- Revision:
- Sheet
- of
- File:

### Library data of the parts
C37 = Cap: Capacitor
SB6-SB8 = Jumper: Jumper Wire
U4 = MAX31855x: Manufacturer PN: MAX31855EASA+; Thermocouple Type: E; DigiKey PN: MAX31855EASA+-ND

## Nets that join several sheets
3V3: I2C_Breakout (5 pins), SPI_Breakout (7 pins), CAN_Breakout (U8.3), Power (11 pins), Thermocouples/Thermocouple_Amplifier1 (C37_Thermocouple_Amplifier1.2 U4_Thermocouple_Amplifier1.4), Thermocouples/Thermocouple_Amplifier2 (C37_Thermocouple_Amplifier2.2 U4_Thermocouple_Amplifier2.4), Thermocouples/Thermocouple_Amplifier3 (C37_Thermocouple_Amplifier3.2 U4_Thermocouple_Amplifier3.4), Thermocouples/Thermocouple_Amplifier4 (C37_Thermocouple_Amplifier4.2 U4_Thermocouple_Amplifier4.4)
GND: I2C_Breakout (5 pins), MCU (5 pins), GPIO_Breakout (J1.SHIELD), SPI_Breakout (5 pins), CAN_Breakout (J9.SHIELD U8.2), ADC_GPIO_Breakout (J4.SHIELD), SWD-USB (J8.4), Power (28 pins), Thermocouples (J6.SHIELD), Thermocouples/Thermocouple_Amplifier1 (C37_Thermocouple_Amplifier1.1 U4_Thermocouple_Amplifier1.1), Thermocouples/Thermocouple_Amplifier2 (C37_Thermocouple_Amplifier2.1 U4_Thermocouple_Amplifier2.1), Thermocouples/Thermocouple_Amplifier3 (C37_Thermocouple_Amplifier3.1 U4_Thermocouple_Amplifier3.1), Thermocouples/Thermocouple_Amplifier4 (C37_Thermocouple_Amplifier4.1 U4_Thermocouple_Amplifier4.1)
CS: MCU (U1.81), Thermocouples/Thermocouple_Amplifier1 (SB6_Thermocouple_Amplifier1.2)
CS: MCU (U1.82), Thermocouples/Thermocouple_Amplifier2 (SB6_Thermocouple_Amplifier2.2)
CS: MCU (U1.83), Thermocouples/Thermocouple_Amplifier3 (SB6_Thermocouple_Amplifier3.2)
CS: MCU (U1.84), Thermocouples/Thermocouple_Amplifier4 (SB6_Thermocouple_Amplifier4.2)
GPIO 38: MCU (U1.38), GPIO_Breakout (J1.1)
GPIO 39: MCU (U1.39), GPIO_Breakout (J1.2)
GPIO 40: MCU (U1.40), GPIO_Breakout (J1.3)
GPIO 41: MCU (U1.41), GPIO_Breakout (J1.4)
GPIO 42: MCU (U1.42), GPIO_Breakout (J1.5)
GPIO 43: MCU (U1.43), GPIO_Breakout (J1.6)
GPIO 44: MCU (U1.44), GPIO_Breakout (J1.7)
GPIO 45: MCU (U1.45), GPIO_Breakout (J1.8)
GPIO 46: MCU (U1.46), GPIO_Breakout (J1.9)
GPIO 53: MCU (U1.53), GPIO_Breakout (J1.10)
GPIO 54: MCU (U1.54), GPIO_Breakout (J1.11)
GPIO 55: MCU (U1.55), GPIO_Breakout (J1.12)
GPIO 56: MCU (U1.56), GPIO_Breakout (J1.13)
GPIO 57: MCU (U1.57), GPIO_Breakout (J1.14)
GPIO 58: MCU (U1.58), GPIO_Breakout (J1.15)
GPIO 59: MCU (U1.59), GPIO_Breakout (J1.16)
GPIO 60: MCU (U1.60), GPIO_Breakout (J1.17)
GPIO 61: MCU (U1.61), GPIO_Breakout (J1.18)
GPIO 62: MCU (U1.62), GPIO_Breakout (J1.19)
GPIO 63: MCU (U1.63), GPIO_Breakout (J1.20)
GPIO 64: MCU (U1.64), GPIO_Breakout (J1.21)
GPIO 65: MCU (U1.65), GPIO_Breakout (J1.22)
GPIO 96: MCU (U1.96), GPIO_Breakout (J1.23)
GPIO 97: MCU (U1.97), GPIO_Breakout (J1.24)
GPIO 98: MCU (U1.98), GPIO_Breakout (J1.25)
NetC22_2: MCU (U1.6), Power (C22.2 FB1.1)
NetC23_2: MCU (U1.100), Power (C23.2 FB2.1)
NetC24_2: MCU (U1.75), Power (C24.2 FB3.1)
NetC25_2: MCU (U1.50), Power (C25.2 FB4.1)
NetC26_2: MCU (U1.28), Power (C26.2 FB5.1)
NetC27_2: MCU (U1.19), Power (C27.2 FB6.1)
NetC28_2: MCU (U1.11), Power (C28.2 FB7.1)
NetC29_2: MCU (U1.49), Power (C29.2)
NetC30_2: MCU (U1.73), Power (C30.2)
NetC31_2: MCU (U1.22), Power (C31.2 C32.2 FB8.1 R15.2)
NetC33_1: MCU (U1.21), Power (C33.1 C34.1 R15.1)
NetJ4_1: MCU (U1.15), ADC_GPIO_Breakout (J4.1)
NetJ4_2: MCU (U1.29), ADC_GPIO_Breakout (J4.2)
NetJ4_3: MCU (U1.30), ADC_GPIO_Breakout (J4.3)
NetJ4_4: MCU (U1.31), ADC_GPIO_Breakout (J4.4)
NetR3_1: I2C_Breakout (R3.1), MCU (U1.92)
NetR7_1: MCU (U1.78), SPI_Breakout (R7.1), Thermocouples/Thermocouple_Amplifier1 (SB8_Thermocouple_Amplifier1.2), Thermocouples/Thermocouple_Amplifier2 (SB8_Thermocouple_Amplifier2.2), Thermocouples/Thermocouple_Amplifier3 (SB8_Thermocouple_Amplifier3.2), Thermocouples/Thermocouple_Amplifier4 (SB8_Thermocouple_Amplifier4.2)
NetR16_2: MCU (U1.12), Power (R16.2)
NetR17_2: MCU (U1.94), Power (R17.2)
NetR18_2: MCU (U1.37), Power (R18.2)
NetSB1_1: I2C_Breakout (SB1.1), MCU (U1.93)
NetSB3_1: MCU (U1.79), SPI_Breakout (SB3.1), Thermocouples/Thermocouple_Amplifier1 (SB7_Thermocouple_Amplifier1.2), Thermocouples/Thermocouple_Amplifier2 (SB7_Thermocouple_Amplifier2.2), Thermocouples/Thermocouple_Amplifier3 (SB7_Thermocouple_Amplifier3.2), Thermocouples/Thermocouple_Amplifier4 (SB7_Thermocouple_Amplifier4.2)
NetSB4_1: MCU (U1.80), SPI_Breakout (SB4.1)
NetSB11_1: MCU (U1.13), Power (SB11.1)
NetU1_70: MCU (U1.70), CAN_Breakout (U8.4)
NetU1_71: MCU (U1.71), CAN_Breakout (U8.1)
SS1: MCU (U1.85), SPI_Breakout (J2.25)
SS2: MCU (U1.86), SPI_Breakout (J2.22)
SS3: MCU (U1.87), SPI_Breakout (J2.19)
SS4: MCU (U1.88), SPI_Breakout (J2.16)
T+: Thermocouples (J6.6), Thermocouples/Thermocouple_Amplifier4 (U4_Thermocouple_Amplifier4.3)
T+: Thermocouples (J6.7), Thermocouples/Thermocouple_Amplifier3 (U4_Thermocouple_Amplifier3.3)
T+: Thermocouples (J6.8), Thermocouples/Thermocouple_Amplifier2 (U4_Thermocouple_Amplifier2.3)
T+: Thermocouples (J6.9), Thermocouples/Thermocouple_Amplifier1 (U4_Thermocouple_Amplifier1.3)
T-: Thermocouples (J6.1), Thermocouples/Thermocouple_Amplifier1 (U4_Thermocouple_Amplifier1.2)
T-: Thermocouples (J6.2), Thermocouples/Thermocouple_Amplifier2 (U4_Thermocouple_Amplifier2.2)
T-: Thermocouples (J6.3), Thermocouples/Thermocouple_Amplifier3 (U4_Thermocouple_Amplifier3.2)
T-: Thermocouples (J6.4), Thermocouples/Thermocouple_Amplifier4 (U4_Thermocouple_Amplifier4.2)
T_JTCK: MCU (U1.76), SWD-USB (J8.2)
T_JTMS: MCU (U1.72), SWD-USB (J8.3)